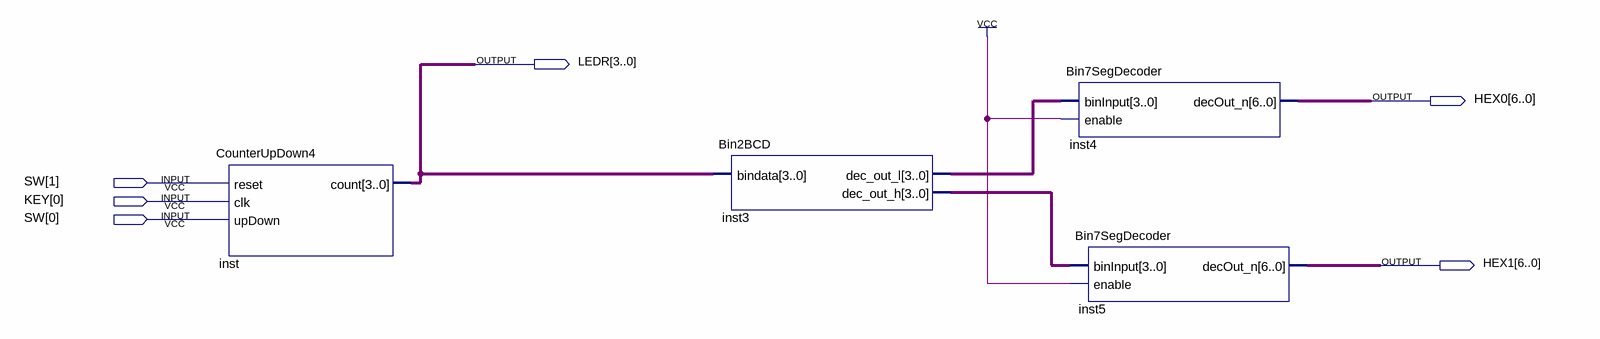
[diagram p0: schematic sheet]
// Quartus schematic Counter_Demo.bdf as structural Verilog: 4 symbols, 6 pins
module Counter_Demo (
  input  [1:0] SW,
  input  [0:0] KEY,
  output [3:0] LEDR,
  output [6:0] HEX0,
  output [6:0] HEX1
);

  wire [3:0] inst3_dec_out_h, inst3_dec_out_l;

  CounterUpDown4 inst (.reset(SW[1]), .clk(KEY[0]), .upDown(SW[0]), .count(LEDR));
  Bin2BCD inst3 (.bindata(LEDR), .dec_out_l(inst3_dec_out_l), .dec_out_h(inst3_dec_out_h));
  Bin7SegDecoder inst4 (.binInput(inst3_dec_out_l), .enable(1'b1), .decOut_n(HEX0));
  Bin7SegDecoder inst5 (.binInput(inst3_dec_out_h), .enable(1'b1), .decOut_n(HEX1));
endmodule
